# Altium schematic sheet cyclone4.SchDoc
size 355 x 398 mm
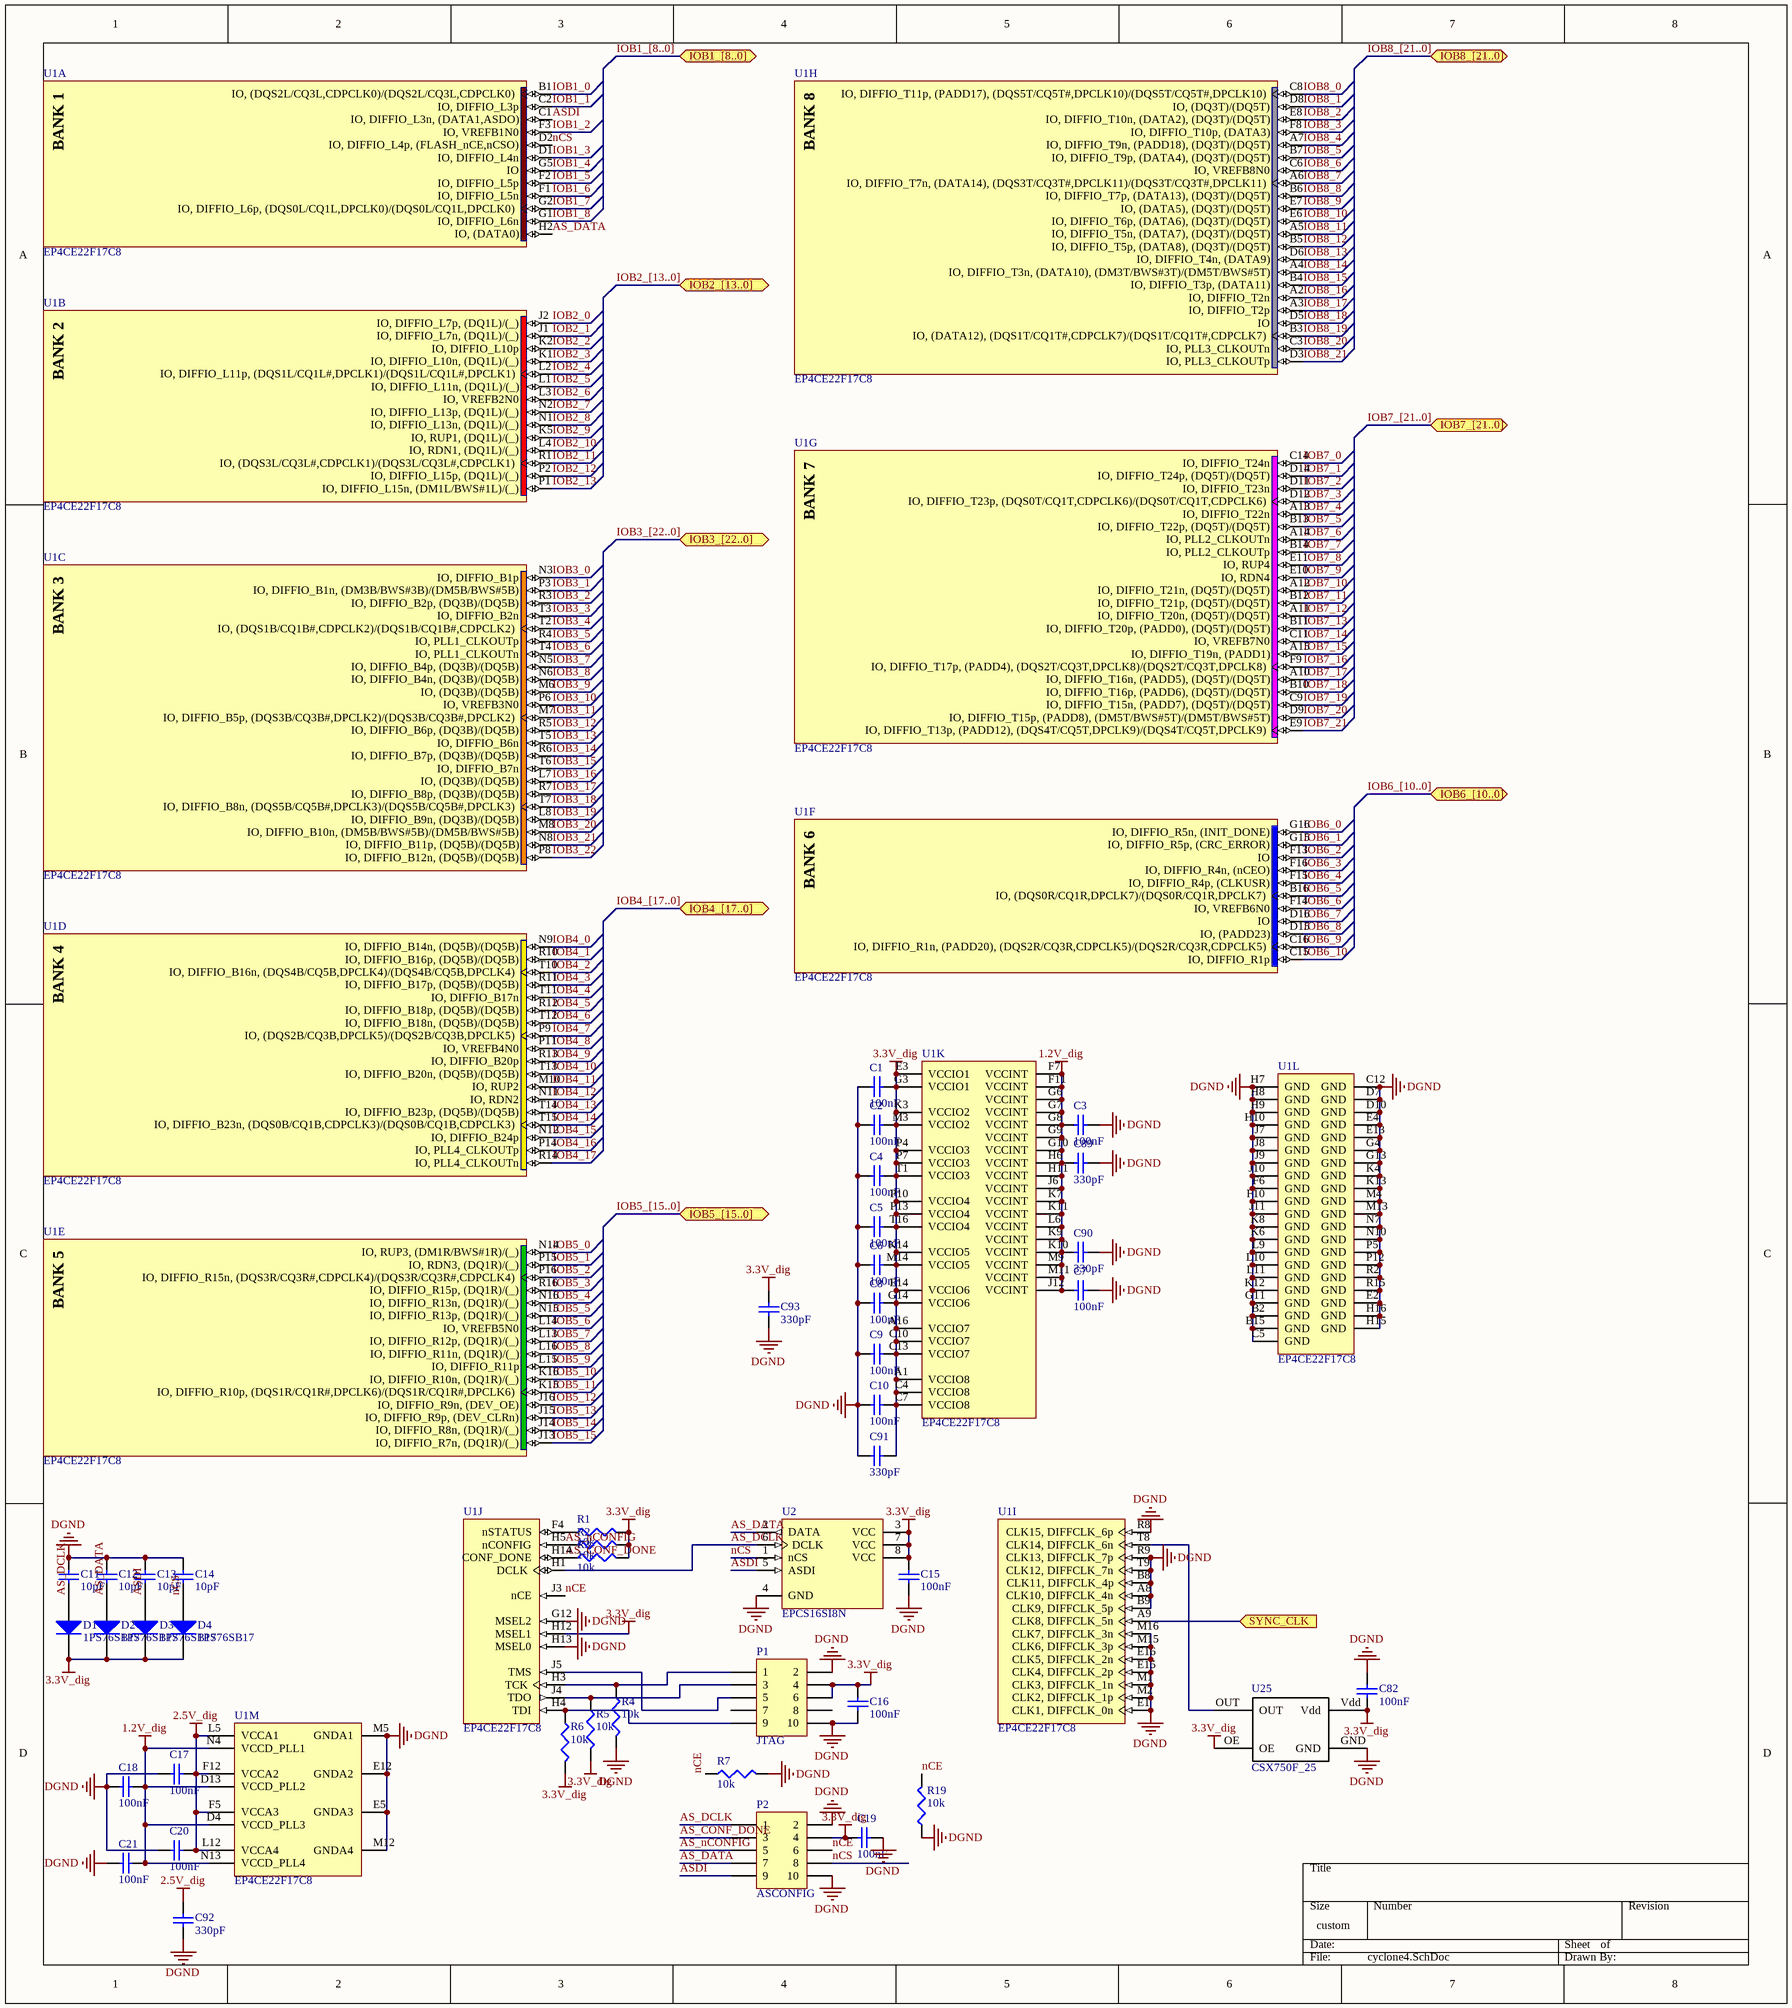
[diagram p0: cyclone4.SchDoc]

## Parts
C1  value 100nF  [CAPC2012L]  (hidden comment: Cap Semi)
C2  value 100nF  [CAPC2012L]  (hidden comment: Cap Semi)
C3  value 100nF  [CAPC2012L]  (hidden comment: Cap Semi)
C4  value 100nF  [CAPC2012L]  (hidden comment: Cap Semi)
C5  value 100nF  [CAPC2012L]  (hidden comment: Cap Semi)
C6  value 100nF  [CAPC2012L]  (hidden comment: Cap Semi)
C7  value 100nF  [CAPC2012L]  (hidden comment: Cap Semi)
C8  value 100nF  [CAPC2012L]  (hidden comment: Cap Semi)
C9  value 100nF  [CAPC2012L]  (hidden comment: Cap Semi)
C10  value 100nF  [CAPC2012L]  (hidden comment: Cap Semi)
C11  value 10pF  [CAPC2012L]  (hidden comment: Cap Semi)
C12  value 10pF  [CAPC2012L]  (hidden comment: Cap Semi)
C13  value 10pF  [CAPC2012L]  (hidden comment: Cap Semi)
C14  value 10pF  [CAPC2012L]  (hidden comment: Cap Semi)
C15  value 100nF  [CAPC2012L]  (hidden comment: Cap Semi)
C16  value 100nF  [CAPC2012L]  (hidden comment: Cap Semi)
C17  value 100nF  [CAPC2012L]  (hidden comment: Cap Semi)
C18  value 100nF  [CAPC2012L]  (hidden comment: Cap Semi)
C19  value 100nF  [CAPC2012L]  (hidden comment: Cap Semi)
C20  value 100nF  [CAPC2012L]  (hidden comment: Cap Semi)
C21  value 100nF  [CAPC2012L]  (hidden comment: Cap Semi)
C82  value 100nF  [CAPC2012L]  (hidden comment: Cap Semi)
C89  value 330pF  [CAPC2012L]  (hidden comment: Cap Semi)
C90  value 330pF  [CAPC2012L]  (hidden comment: Cap Semi)
C91  value 330pF  [CAPC2012L]  (hidden comment: Cap Semi)
C92  value 330pF  [CAPC2012L]  (hidden comment: Cap Semi)
C93  value 330pF  [CAPC2012L]  (hidden comment: Cap Semi)
D1  1PS76SB17  [SOD323]
D2  1PS76SB17  [SOD323]
D3  1PS76SB17  [SOD323]
D4  1PS76SB17  [SOD323]
P1  JTAG  [HDR2X5]
P2  ASCONFIG  [HDR2X5]
R1  value 10k  [RESC3216L]
R2  value 10k  [RESC3216L]
R3  value 10k  [RESC3216L]
R4  value 10k  [RESC3216L]
R5  value 10k  [RESC3216L]
R6  value 10k  [RESC3216L]
R7  value 10k  [RESC3216L]
R19  value 10k  [RESC3216L]
U1  EP4CE22F17C8  [FBGA256]  (parts A,B,C,D,E,F,G,H,I,J,K,L,M of 13)
U2  EPCS16SI8N  [SOIC8_L]
U25  CSX750F_25  [CSX750F]

## Ports
IOB1_[8..0] (bidir), IOB2_[13..0] (bidir), IOB3_[22..0] (bidir), IOB4_[17..0] (bidir), IOB5_[15..0] (bidir), IOB6_[10..0] (bidir), IOB7_[21..0] (bidir), IOB8_[21..0] (bidir), SYNC_CLK (in)

## Nets
1.2V_dig: C3.1 C7.1 C18.2 C21.2 C89.1 C90.1 U1.D4(VCCD_PLL3) U1.D13(VCCD_PLL2) U1.F7(VCCINT) U1.F11(VCCINT) U1.G6(VCCINT) U1.G7(VCCINT) U1.G8(VCCINT) U1.G9(VCCINT) U1.G10(VCCINT) U1.H6(VCCINT) U1.H11(VCCINT) U1.J6(VCCINT) U1.J12(VCCINT) U1.K7(VCCINT) U1.K9(VCCINT) U1.K10(VCCINT) U1.K11(VCCINT) U1.L6(VCCINT) U1.M9(VCCINT) U1.M11(VCCINT) U1.N4(VCCD_PLL1) U1.N13(VCCD_PLL4)
2.5V_dig: C17.2 C20.1 C92.2 U1.F5(VCCA3) U1.F12(VCCA2) U1.L5(VCCA1) U1.L12(VCCA4)
3.3V_dig: C1.2 C2.2 C4.2 C5.2 C6.2 C8.2 C9.2 C10.2 C15.1 C16.1 C19.1 C82.2 C91.2 C93.2 D1.2(K) D2.2(K) D3.2(K) D4.2(K) P1.4 P1.6 P2.4 R1.2 R2.2 R3.2 R5.2 R6.2 U1.A1(VCCIO8) U1.A16(VCCIO7) U1.C4(VCCIO8) U1.C7(VCCIO8) U1.C10(VCCIO7) U1.C13(VCCIO7) U1.E3(VCCIO1) U1.E14(VCCIO6) U1.G3(VCCIO1) U1.G14(VCCIO6) U1.H12(MSEL1) U1.K3(VCCIO2) U1.K14(VCCIO5) U1.M3(VCCIO2) U1.M14(VCCIO5) U1.P4(VCCIO3) U1.P7(VCCIO3) U1.P10(VCCIO4) U1.P13(VCCIO4) U1.T1(VCCIO3) U1.T16(VCCIO4) U2.3(VCC) U2.7(VCC) U2.8(VCC) U25.OE U25.Vdd
DGND: C1.1 C2.1 C3.2 C4.1 C5.1 C6.1 C7.2 C8.1 C9.1 C10.1 C11.2 C12.2 C13.2 C14.2 C15.2 C16.2 C17.1 C18.1 C19.2 C20.2 C21.1 C82.1 C89.2 C90.2 C91.1 C92.1 C93.1 P1.2 P1.10 P2.2 P2.10 R4.2 R7.2 R19.1 U1.A8(CLK10,_DIFFCLK_4n) U1.B2(GND) U1.B8(CLK11,_DIFFCLK_4p) U1.B9(CLK9,_DIFFCLK_5p) U1.B15(GND) U1.C5(GND) U1.C12(GND) U1.D7(GND) U1.D10(GND) U1.E1(CLK1,_DIFFCLK_0n) U1.E2(GND) U1.E4(GND) U1.E5(GNDA3) U1.E12(GNDA2) U1.E13(GND) U1.E15(CLK4,_DIFFCLK_2p) U1.E16(CLK5,_DIFFCLK_2n) U1.F6(GND) U1.F10(GND) U1.G4(GND) U1.G11(GND) U1.G12(MSEL2) U1.G13(GND) U1.H7(GND) U1.H8(GND) U1.H9(GND) U1.H10(GND) U1.H13(MSEL0) U1.H15(GND) U1.H16(GND) U1.J7(GND) U1.J8(GND) U1.J9(GND) U1.J10(GND) U1.J11(GND) U1.K4(GND) U1.K6(GND) U1.K8(GND) U1.K12(GND) U1.K13(GND) U1.L9(GND) U1.L10(GND) U1.L11(GND) U1.M1(CLK3,_DIFFCLK_1n) U1.M2(CLK2,_DIFFCLK_1p) U1.M4(GND) U1.M5(GNDA1) U1.M12(GNDA4) U1.M13(GND) U1.M15(CLK6,_DIFFCLK_3p) U1.M16(CLK7,_DIFFCLK_3n) U1.N7(GND) U1.N10(GND) U1.P5(GND) U1.P12(GND) U1.R2(GND) U1.R8(CLK15,_DIFFCLK_6p) U1.R9(CLK13,_DIFFCLK_7p) U1.R15(GND) U1.T9(CLK12,_DIFFCLK_7n) U2.4(GND) U25.GND
AS_CONF_DONE: P2.3 R3.1 U1.H14(CONF_DONE)
AS_DATA: C12.1 D2.1(A) P2.7 U1.H2(IO,_(DATA0)) U2.2(DATA)
AS_DCLK: C11.1 D1.1(A) P2.1 U1.H1(DCLK) U2.6(DCLK)
AS_nCONFIG: P2.5 R2.1 U1.H5(nCONFIG)
ASDI: C13.1 D3.1(A) P2.9 U1.C1(IO,_DIFFIO_L3n,_(DATA1,ASDO)) U2.5(ASDI)
IOB1_0: U1.B1(IO,_(DQS2L/CQ3L,CDPCLK0)/(DQS2L/CQ3L,CDPCLK0))
IOB1_1: U1.C2(IO,_DIFFIO_L3p)
IOB1_2: U1.F3(IO,_VREFB1N0)
IOB1_3: U1.D1(IO,_DIFFIO_L4n)
IOB1_4: U1.G5(IO)
IOB1_5: U1.F2(IO,_DIFFIO_L5p)
IOB1_6: U1.F1(IO,_DIFFIO_L5n)
IOB1_7: U1.G2(IO,_DIFFIO_L6p,_(DQS0L/CQ1L,DPCLK0)/(DQS0L/CQ1L,DPCLK0))
IOB1_8: U1.G1(IO,_DIFFIO_L6n)
IOB2_0: U1.J2(IO,_DIFFIO_L7p,_(DQ1L)/(_))
IOB2_1: U1.J1(IO,_DIFFIO_L7n,_(DQ1L)/(_))
IOB2_2: U1.K2(IO,_DIFFIO_L10p)
IOB2_3: U1.K1(IO,_DIFFIO_L10n,_(DQ1L)/(_))
IOB2_4: U1.L2(IO,_DIFFIO_L11p,_(DQS1L/CQ1L#,DPCLK1)/(DQS1L/CQ1L#,DPCLK1))
IOB2_5: U1.L1(IO,_DIFFIO_L11n,_(DQ1L)/(_))
IOB2_6: U1.L3(IO,_VREFB2N0)
IOB2_7: U1.N2(IO,_DIFFIO_L13p,_(DQ1L)/(_))
IOB2_8: U1.N1(IO,_DIFFIO_L13n,_(DQ1L)/(_))
IOB2_9: U1.K5(IO,_RUP1,_(DQ1L)/(_))
IOB2_10: U1.L4(IO,_RDN1,_(DQ1L)/(_))
IOB2_11: U1.R1(IO,_(DQS3L/CQ3L#,CDPCLK1)/(DQS3L/CQ3L#,CDPCLK1))
IOB2_12: U1.P2(IO,_DIFFIO_L15p,_(DQ1L)/(_))
IOB2_13: U1.P1(IO,_DIFFIO_L15n,_(DM1L/BWS#1L)/(_))
IOB3_0: U1.N3(IO,_DIFFIO_B1p)
IOB3_1: U1.P3(IO,_DIFFIO_B1n,_(DM3B/BWS#3B)/(DM5B/BWS#5B))
IOB3_2: U1.R3(IO,_DIFFIO_B2p,_(DQ3B)/(DQ5B))
IOB3_3: U1.T3(IO,_DIFFIO_B2n)
IOB3_4: U1.T2(IO,_(DQS1B/CQ1B#,CDPCLK2)/(DQS1B/CQ1B#,CDPCLK2))
IOB3_5: U1.R4(IO,_PLL1_CLKOUTp)
IOB3_6: U1.T4(IO,_PLL1_CLKOUTn)
IOB3_7: U1.N5(IO,_DIFFIO_B4p,_(DQ3B)/(DQ5B))
IOB3_8: U1.N6(IO,_DIFFIO_B4n,_(DQ3B)/(DQ5B))
IOB3_9: U1.M6(IO,_(DQ3B)/(DQ5B))
IOB3_10: U1.P6(IO,_VREFB3N0)
IOB3_11: U1.M7(IO,_DIFFIO_B5p,_(DQS3B/CQ3B#,DPCLK2)/(DQS3B/CQ3B#,DPCLK2))
IOB3_12: U1.R5(IO,_DIFFIO_B6p,_(DQ3B)/(DQ5B))
IOB3_13: U1.T5(IO,_DIFFIO_B6n)
IOB3_14: U1.R6(IO,_DIFFIO_B7p,_(DQ3B)/(DQ5B))
IOB3_15: U1.T6(IO,_DIFFIO_B7n)
IOB3_16: U1.L7(IO,_(DQ3B)/(DQ5B))
IOB3_17: U1.R7(IO,_DIFFIO_B8p,_(DQ3B)/(DQ5B))
IOB3_18: U1.T7(IO,_DIFFIO_B8n,_(DQS5B/CQ5B#,DPCLK3)/(DQS5B/CQ5B#,DPCLK3))
IOB3_19: U1.L8(IO,_DIFFIO_B9n,_(DQ3B)/(DQ5B))
IOB3_20: U1.M8(IO,_DIFFIO_B10n,_(DM5B/BWS#5B)/(DM5B/BWS#5B))
IOB3_21: U1.N8(IO,_DIFFIO_B11p,_(DQ5B)/(DQ5B))
IOB3_22: U1.P8(IO,_DIFFIO_B12n,_(DQ5B)/(DQ5B))
IOB4_0: U1.N9(IO,_DIFFIO_B14n,_(DQ5B)/(DQ5B))
IOB4_1: U1.R10(IO,_DIFFIO_B16p,_(DQ5B)/(DQ5B))
IOB4_2: U1.T10(IO,_DIFFIO_B16n,_(DQS4B/CQ5B,DPCLK4)/(DQS4B/CQ5B,DPCLK4))
IOB4_3: U1.R11(IO,_DIFFIO_B17p,_(DQ5B)/(DQ5B))
IOB4_4: U1.T11(IO,_DIFFIO_B17n)
IOB4_5: U1.R12(IO,_DIFFIO_B18p,_(DQ5B)/(DQ5B))
IOB4_6: U1.T12(IO,_DIFFIO_B18n,_(DQ5B)/(DQ5B))
IOB4_7: U1.P9(IO,_(DQS2B/CQ3B,DPCLK5)/(DQS2B/CQ3B,DPCLK5))
IOB4_8: U1.P11(IO,_VREFB4N0)
IOB4_9: U1.R13(IO,_DIFFIO_B20p)
IOB4_10: U1.T13(IO,_DIFFIO_B20n,_(DQ5B)/(DQ5B))
IOB4_11: U1.M10(IO,_RUP2)
IOB4_12: U1.N11(IO,_RDN2)
IOB4_13: U1.T14(IO,_DIFFIO_B23p,_(DQ5B)/(DQ5B))
IOB4_14: U1.T15(IO,_DIFFIO_B23n,_(DQS0B/CQ1B,CDPCLK3)/(DQS0B/CQ1B,CDPCLK3))
IOB4_15: U1.N12(IO,_DIFFIO_B24p)
IOB4_16: U1.P14(IO,_PLL4_CLKOUTp)
IOB4_17: U1.R14(IO,_PLL4_CLKOUTn)
IOB5_0: U1.N14(IO,_RUP3,_(DM1R/BWS#1R)/(_))
IOB5_1: U1.P15(IO,_RDN3,_(DQ1R)/(_))
IOB5_2: U1.P16(IO,_DIFFIO_R15n,_(DQS3R/CQ3R#,CDPCLK4)/(DQS3R/CQ3R#,CDPCLK4))
IOB5_3: U1.R16(IO,_DIFFIO_R15p,_(DQ1R)/(_))
IOB5_4: U1.N16(IO,_DIFFIO_R13n,_(DQ1R)/(_))
IOB5_5: U1.N15(IO,_DIFFIO_R13p,_(DQ1R)/(_))
IOB5_6: U1.L14(IO,_VREFB5N0)
IOB5_7: U1.L13(IO,_DIFFIO_R12p,_(DQ1R)/(_))
IOB5_8: U1.L16(IO,_DIFFIO_R11n,_(DQ1R)/(_))
IOB5_9: U1.L15(IO,_DIFFIO_R11p)
IOB5_10: U1.K16(IO,_DIFFIO_R10n,_(DQ1R)/(_))
IOB5_11: U1.K15(IO,_DIFFIO_R10p,_(DQS1R/CQ1R#,DPCLK6)/(DQS1R/CQ1R#,DPCLK6))
IOB5_12: U1.J16(IO,_DIFFIO_R9n,_(DEV_OE))
IOB5_13: U1.J15(IO,_DIFFIO_R9p,_(DEV_CLRn))
IOB5_14: U1.J14(IO,_DIFFIO_R8n,_(DQ1R)/(_))
IOB5_15: U1.J13(IO,_DIFFIO_R7n,_(DQ1R)/(_))
IOB6_0: U1.G16(IO,_DIFFIO_R5n,_(INIT_DONE))
IOB6_1: U1.G15(IO,_DIFFIO_R5p,_(CRC_ERROR))
IOB6_2: U1.F13(IO)
IOB6_3: U1.F16(IO,_DIFFIO_R4n,_(nCEO))
IOB6_4: U1.F15(IO,_DIFFIO_R4p,_(CLKUSR))
IOB6_5: U1.B16(IO,_(DQS0R/CQ1R,DPCLK7)/(DQS0R/CQ1R,DPCLK7))
IOB6_6: U1.F14(IO,_VREFB6N0)
IOB6_7: U1.D16(IO)
IOB6_8: U1.D15(IO,_(PADD23))
IOB6_9: U1.C16(IO,_DIFFIO_R1n,_(PADD20),_(DQS2R/CQ3R,CDPCLK5)/(DQS2R/CQ3R,CDPCLK5))
IOB6_10: U1.C15(IO,_DIFFIO_R1p)
IOB7_0: U1.C14(IO,_DIFFIO_T24n)
IOB7_1: U1.D14(IO,_DIFFIO_T24p,_(DQ5T)/(DQ5T))
IOB7_2: U1.D11(IO,_DIFFIO_T23n)
IOB7_3: U1.D12(IO,_DIFFIO_T23p,_(DQS0T/CQ1T,CDPCLK6)/(DQS0T/CQ1T,CDPCLK6))
IOB7_4: U1.A13(IO,_DIFFIO_T22n)
IOB7_5: U1.B13(IO,_DIFFIO_T22p,_(DQ5T)/(DQ5T))
IOB7_6: U1.A14(IO,_PLL2_CLKOUTn)
IOB7_7: U1.B14(IO,_PLL2_CLKOUTp)
IOB7_8: U1.E11(IO,_RUP4)
IOB7_9: U1.E10(IO,_RDN4)
IOB7_10: U1.A12(IO,_DIFFIO_T21n,_(DQ5T)/(DQ5T))
IOB7_11: U1.B12(IO,_DIFFIO_T21p,_(DQ5T)/(DQ5T))
IOB7_12: U1.A11(IO,_DIFFIO_T20n,_(DQ5T)/(DQ5T))
IOB7_13: U1.B11(IO,_DIFFIO_T20p,_(PADD0),_(DQ5T)/(DQ5T))
IOB7_14: U1.C11(IO,_VREFB7N0)
IOB7_15: U1.A15(IO,_DIFFIO_T19n,_(PADD1))
IOB7_16: U1.F9(IO,_DIFFIO_T17p,_(PADD4),_(DQS2T/CQ3T,DPCLK8)/(DQS2T/CQ3T,DPCLK8))
IOB7_17: U1.A10(IO,_DIFFIO_T16n,_(PADD5),_(DQ5T)/(DQ5T))
IOB7_18: U1.B10(IO,_DIFFIO_T16p,_(PADD6),_(DQ5T)/(DQ5T))
IOB7_19: U1.C9(IO,_DIFFIO_T15n,_(PADD7),_(DQ5T)/(DQ5T))
IOB7_20: U1.D9(IO,_DIFFIO_T15p,_(PADD8),_(DM5T/BWS#5T)/(DM5T/BWS#5T))
IOB7_21: U1.E9(IO,_DIFFIO_T13p,_(PADD12),_(DQS4T/CQ5T,DPCLK9)/(DQS4T/CQ5T,DPCLK9))
IOB8_0: U1.C8(IO,_DIFFIO_T11p,_(PADD17),_(DQS5T/CQ5T#,DPCLK10)/(DQS5T/CQ5T#,DPCLK10))
IOB8_1: U1.D8(IO,_(DQ3T)/(DQ5T))
IOB8_2: U1.E8(IO,_DIFFIO_T10n,_(DATA2),_(DQ3T)/(DQ5T))
IOB8_3: U1.F8(IO,_DIFFIO_T10p,_(DATA3))
IOB8_4: U1.A7(IO,_DIFFIO_T9n,_(PADD18),_(DQ3T)/(DQ5T))
IOB8_5: U1.B7(IO,_DIFFIO_T9p,_(DATA4),_(DQ3T)/(DQ5T))
IOB8_6: U1.C6(IO,_VREFB8N0)
IOB8_7: U1.A6(IO,_DIFFIO_T7n,_(DATA14),_(DQS3T/CQ3T#,DPCLK11)/(DQS3T/CQ3T#,DPCLK11))
IOB8_8: U1.B6(IO,_DIFFIO_T7p,_(DATA13),_(DQ3T)/(DQ5T))
IOB8_9: U1.E7(IO,_(DATA5),_(DQ3T)/(DQ5T))
IOB8_10: U1.E6(IO,_DIFFIO_T6p,_(DATA6),_(DQ3T)/(DQ5T))
IOB8_11: U1.A5(IO,_DIFFIO_T5n,_(DATA7),_(DQ3T)/(DQ5T))
IOB8_12: U1.B5(IO,_DIFFIO_T5p,_(DATA8),_(DQ3T)/(DQ5T))
IOB8_13: U1.D6(IO,_DIFFIO_T4n,_(DATA9))
IOB8_14: U1.A4(IO,_DIFFIO_T3n,_(DATA10),_(DM3T/BWS#3T)/(DM5T/BWS#5T))
IOB8_15: U1.B4(IO,_DIFFIO_T3p,_(DATA11))
IOB8_16: U1.A2(IO,_DIFFIO_T2n)
IOB8_17: U1.A3(IO,_DIFFIO_T2p)
IOB8_18: U1.D5(IO)
IOB8_19: U1.B3(IO,_(DATA12),_(DQS1T/CQ1T#,CDPCLK7)/(DQS1T/CQ1T#,CDPCLK7))
IOB8_20: U1.C3(IO,_PLL3_CLKOUTn)
IOB8_21: U1.D3(IO,_PLL3_CLKOUTp)
nCE: P2.6 R7.1 R19.2 U1.J3(nCE)
nCS: C14.1 D4.1(A) P2.8 U1.D2(IO,_DIFFIO_L4p,_(FLASH_nCE,nCSO)) U2.1(nCS)
SYNC_CLK: U1.A9(CLK8,_DIFFCLK_5n) ; port SYNC_CLK
NetP1_1: P1.1 R4.1 U1.H3(TCK)
NetP1_3: P1.3 R5.1 U1.J4(TDO)
NetP1_5: P1.5 U1.J5(TMS)
NetP1_9: P1.9 R6.1 U1.H4(TDI)
NetR1_1: R1.1 U1.F4(nSTATUS)
NetU1_T8: U1.T8(CLK14,_DIFFCLK_6n) U25.OUT

Not connected (* = marked no-connect by the designer): P1 7 8

## Buses and harness runs
bus IOB1_[8..0] = port IOB1_[8..0]
bus IOB2_[13..0] = port IOB2_[13..0]
bus IOB3_[22..0] = port IOB3_[22..0]
bus IOB4_[17..0] = port IOB4_[17..0]
bus IOB5_[15..0] = port IOB5_[15..0]
bus IOB6_[10..0] = port IOB6_[10..0]
bus IOB7_[21..0] = port IOB7_[21..0]
bus IOB8_[21..0] = port IOB8_[21..0]

## Notes on the sheet
- (in symbol EP4CE22F17C8, part A) BANK 1
- (in symbol EP4CE22F17C8, part B) BANK 2
- (in symbol EP4CE22F17C8, part C) BANK 3
- (in symbol EP4CE22F17C8, part D) BANK 4
- (in symbol EP4CE22F17C8, part E) BANK 5
- (in symbol EP4CE22F17C8, part F) BANK 6
- (in symbol EP4CE22F17C8, part G) BANK 7
- (in symbol EP4CE22F17C8, part H) BANK 8

## Library data of the parts
C1-C21 C82 C89-C93 = Cap Semi: Capacitor (Semiconductor SIM Model); Published: 8-Jun-2000; LatestRevisionDate: 29-May-2009; LatestRevisionNote: IPC-7351 Footprint Added.; PackageReference: C1206; Publisher: Altium Limited; PackageDescription: Chip Capacitor
D1-D4 = Diode: Default Diode; Published: 8-Jun-2000; LatestRevisionDate: 17-Jul-2002; LatestRevisionNote: Re-released for DXP Platform.; PackageVersion: Sep-1996; PackageReference: SMC; Publisher: Altium Limited; Code_JEDEC: DO-214-AB
P1 P2 = Header 5X2: Header, 5-Pin, Dual row; LatestRevisionDate: 17-Jul-2002; LatestRevisionNote: Re-released for DXP Platform.; Publisher: Altium Limited
R1-R7 R19 = Res3: Resistor; Published: 8-Jun-2000; LatestRevisionDate: 29-May-2009; LatestRevisionNote: IPC-7351 Footprint Added.; PackageReference: J1-0603; Publisher: Altium Limited; PackageDescription: Chip Resistor
U1 = EP4CE22F17C8: Cyclone IV Family FPGA, 2V Core, 153 I/O Pins, 4 PLLs, 256-Pin FBGA, Speed Grade 8, Commercial Grade; Published: 3-May-2010; DatasheetVersion: ver1.2, Mar-2010; PackageVersion: ver16.0, Dec-2009; PackageReference: FBGA256; Publisher: Altium Limited; PackageDescription: 256-Ball FineLine Ball Grid Array (FBGA256) - Option 1 - Wire Bond; Supplier 1: Digi-Key; Supplier Part Number 1: EP4CE22F17C8-ND; Code_JEDEC: MS-034-AAF-1; Code_IPC: BGA100P16X16-256; ComponentLink1Description: Manufacturer Link; ComponentLink1URL: http://www.altera.com/; ComponentLink2Description: Handbook; ComponentLink2URL: http://www.altera.com/literature/hb/cyclone-iv/cyclone4-handbook.pdf; ComponentLink3Description: Pinout Specification; ComponentLink3URL: http://www.altera.com/literature/lit-dp.jsp?category=cyc%204&showspreadsheet=y; ComponentLink4Description: Packaging Specification; ComponentLink4URL: http://www.altera.com/literature/ds/dspkg.pdf
U2 = EPCS4SI8N: EPCS4 Series, In-system programmable 3.3V serial configuration device, 8-Pin SOIC, 4-Megabit, Industrial Grade, Pb-Free; Configures: Cyclone II, Stratix II, & Cyclone Devices; Published: 4-Mar-2005; LatestRevisionDate: 13-Apr-2006; LatestRevisionNote: IPC-7351 Footprint Added.; DatasheetVersion: ver2.0, Oct-2003; PackageVersion: ver13.0, May-2005; PackageReference: SOIC8; Publisher: Altium Limited; PackageDescription: 8-Pin Small Outline Integrated Circuit Package (SOIC8); Code_JEDEC: MS-012-AA; Code_IPC: SOIC127P600-8; ComponentLink1Description: Manufacturer Link; ComponentLink1URL: http://www.altera.com/products/devices/config/cfg-index.html; ComponentLink2Description: Configuration Handbook; ComponentLink2URL: http://www.altera.com/literature/hb/cfg/config_handbook.pdf; ComponentLink3Description: Pinout Specification; ComponentLink3URL: http://www.altera.com/literature/hb/cfg/cyc_c51014.pdf; ComponentLink4Description: Packaging Specification; ComponentLink4URL: http://www.altera.com/literature/ds/dspkg.pdf
U25 = CSX750F: Clock Oscillator; pin to pad: GND>2 OE>1 OUT>3 Vdd>4